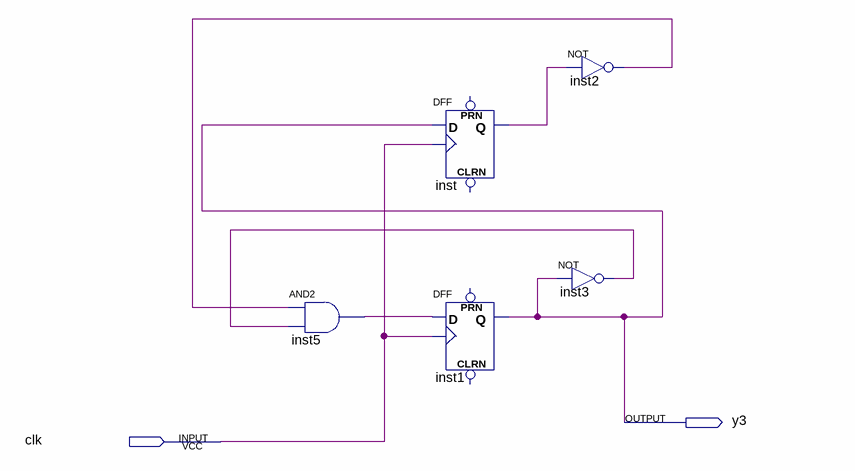
[diagram p0: schematic sheet]
// Quartus schematic 3Xdec.bdf as structural Verilog: 5 symbols, 2 pins
module \3Xdec  (
  input  clk,
  output y3
);

  wire inst2_out, inst3_out, inst5_out, inst_q;

  and inst5 (inst5_out, inst2_out, inst3_out);
  DFF inst (.CLK(clk), .D(y3), .Q(inst_q));  // open: CLRN, PRN
  DFF inst1 (.CLK(clk), .D(inst5_out), .Q(y3));  // open: CLRN, PRN
  not inst3 (inst3_out, y3);
  not inst2 (inst2_out, inst_q);
endmodule
